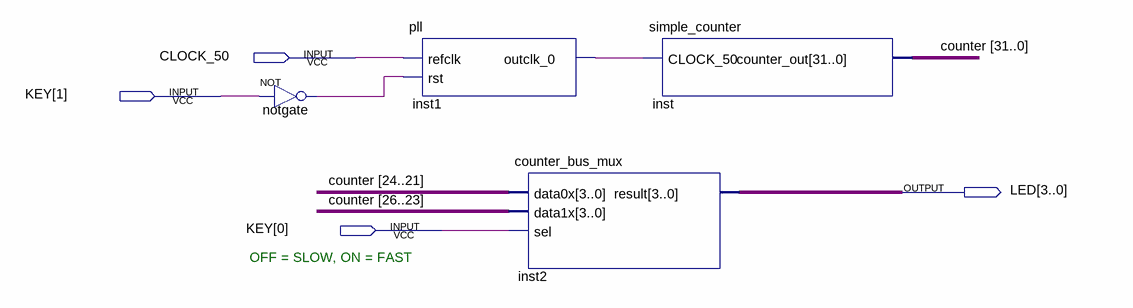
[diagram p0: schematic sheet]
// Quartus schematic LEDblink.bdf as structural Verilog: 4 symbols, 4 pins
module LEDblink (
  input  CLOCK_50,
  input  [1:0] KEY,
  output [3:0] LED
);

  wire inst1_outclk_0, notgate_out;
  wire [31:0] counter;

  not notgate (notgate_out, KEY[1]);
  pll inst1 (.refclk(CLOCK_50), .rst(notgate_out), .outclk_0(inst1_outclk_0));
  counter_bus_mux inst2 (.data0x(counter[24:21]), .data1x(counter[26:23]), .sel(KEY[0]), .result(LED));
  simple_counter inst (.CLOCK_50(inst1_outclk_0), .counter_out(counter));

  // Notes on the sheet:
  //   OFF = SLOW, ON = FAST
endmodule
